# Altium schematic sheet Digital_Input.SchDoc
size A3; SheetNumber: 9; SheetTotal: 29
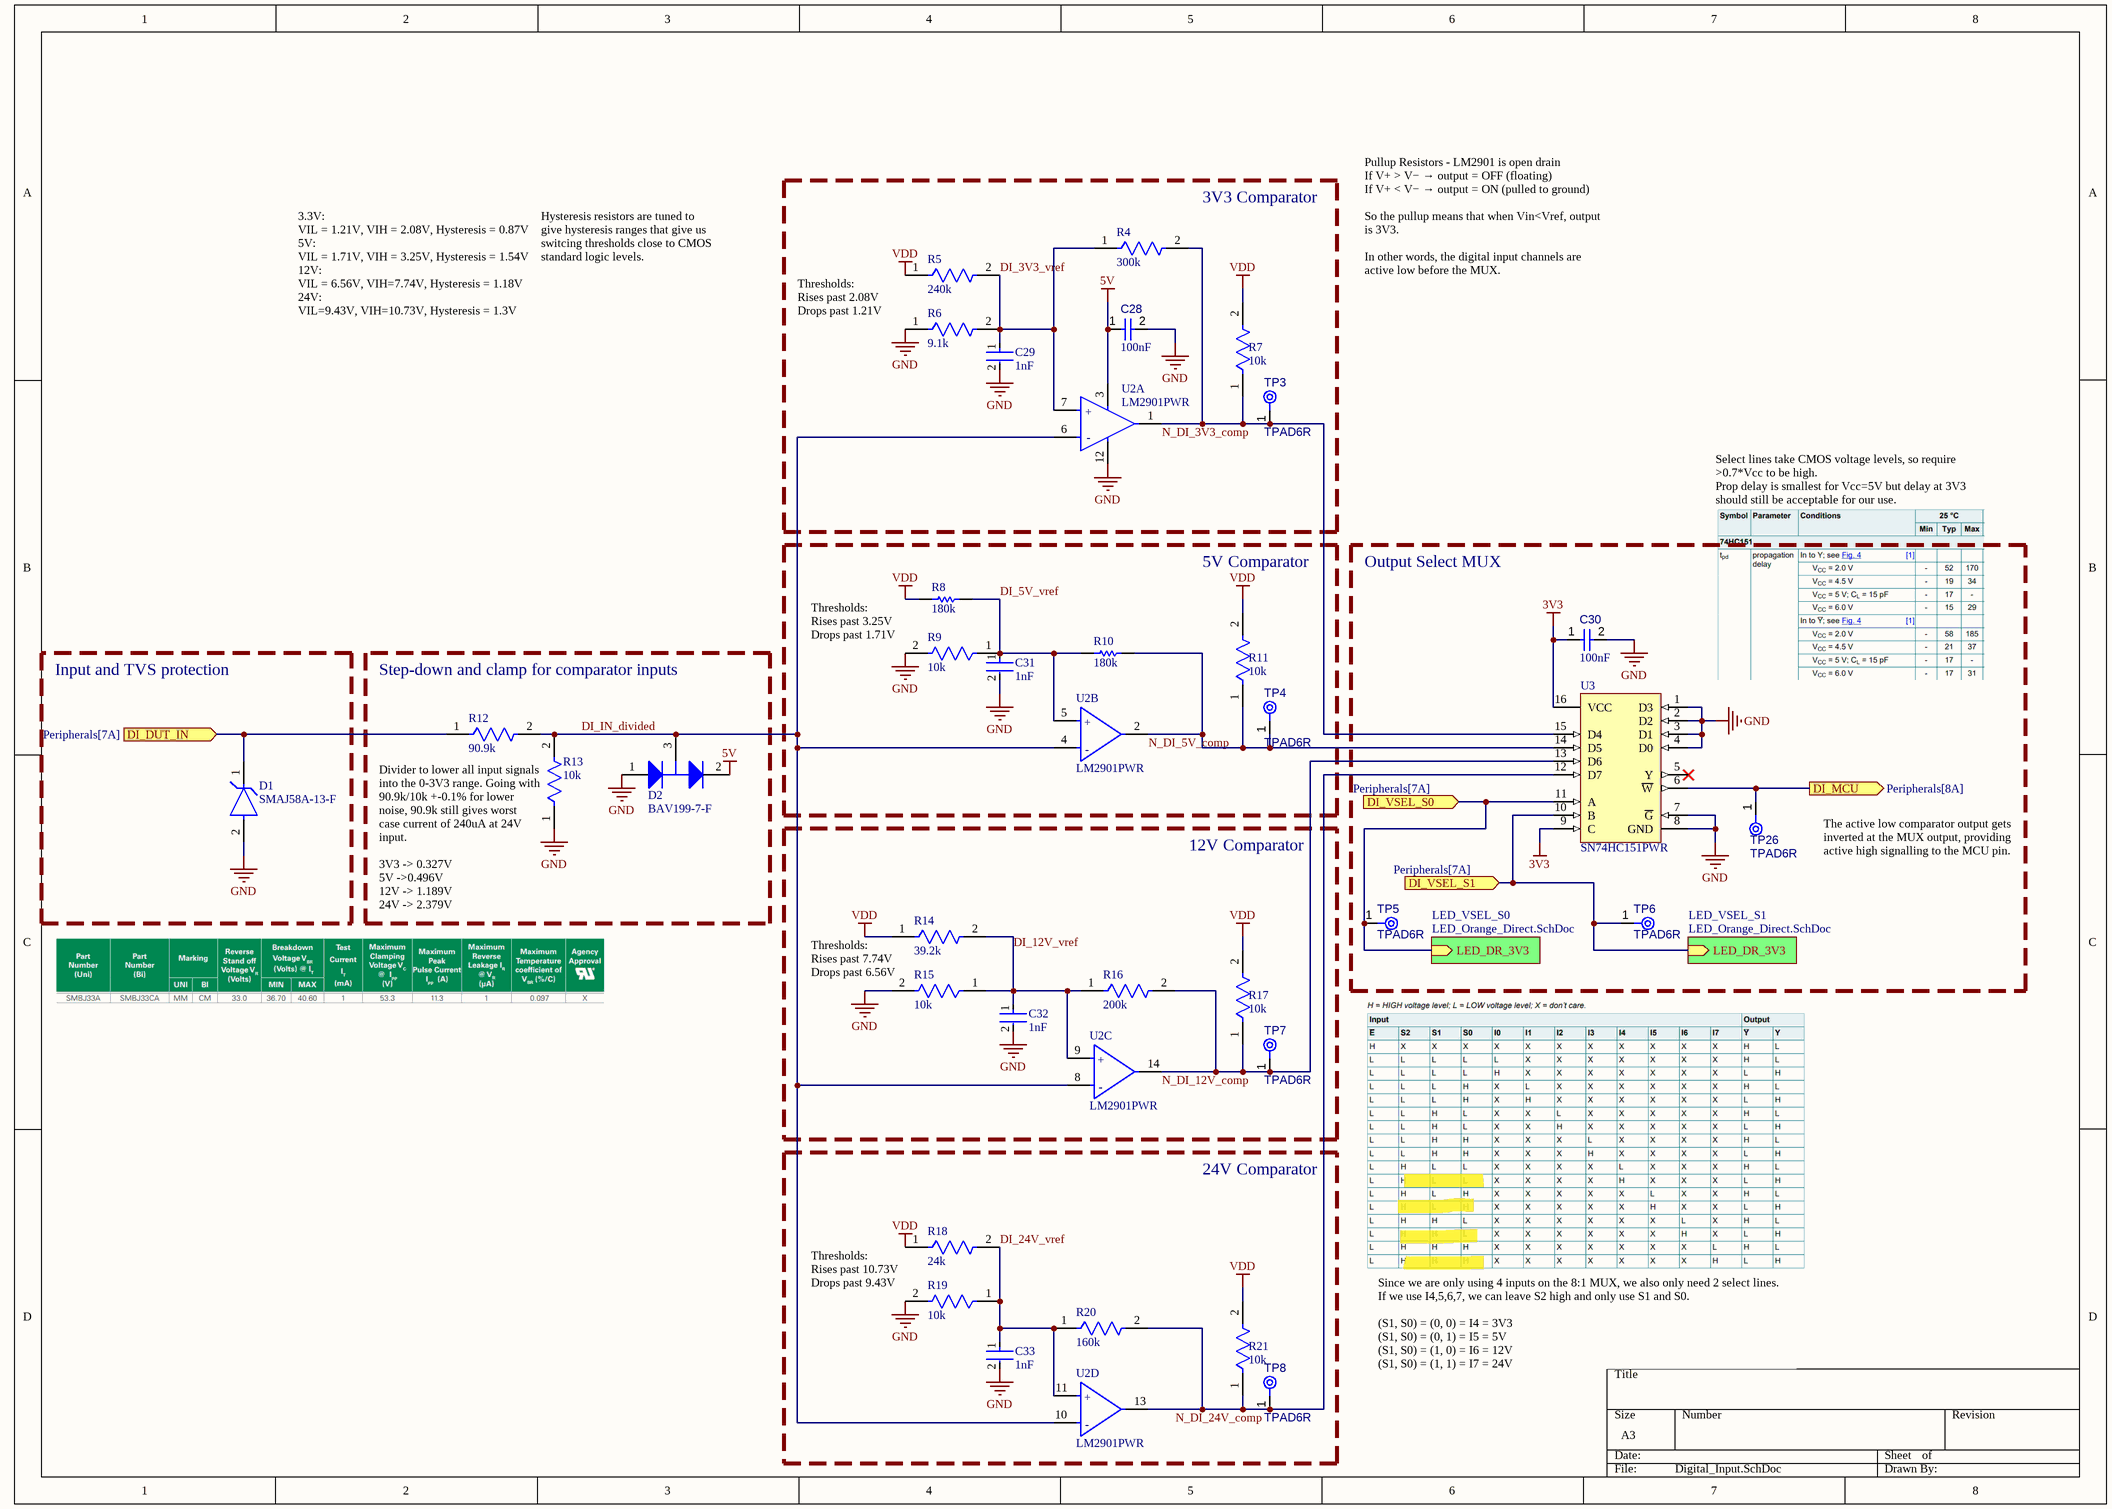
[diagram p0: Digital_Input.SchDoc]

## Parts
C28  value 100nF  [CAPC1608X90X40NL10T20]  (hidden comment: Capacitor 100 nF +/-10% 50 V 0603)
C29  value 1nF  [FP-CC0603-DA-IPC_B]  (hidden comment: CC0603KRX7R7BB102)
C30  value 100nF  [CAPC1608X90X40NL10T20]  (hidden comment: Capacitor 100 nF +/-10% 50 V 0603)
C31  value 1nF  [FP-CC0603-DA-IPC_B]  (hidden comment: CC0603KRX7R7BB102)
C32  value 1nF  [FP-CC0603-DA-IPC_B]  (hidden comment: CC0603KRX7R7BB102)
C33  value 1nF  [FP-CC0603-DA-IPC_B]  (hidden comment: CC0603KRX7R7BB102)
D1  SMAJ58A-13-F  [FP-SMA-MFG]
D2  BAV199-7-F  [DIOD-SOT23-3_A_V]
R4  value 300k  [FP-RT0603-IPC_C]  (hidden comment: RT0603BRE07300KL)
R5  value 240k  [FP-RT0603-IPC_C]  (hidden comment: RT0603BRD07240KL)
R6  value 9.1k  [FP-RT0603-IPC_C]  (hidden comment: RT0603BRD079K1L)
R7  value 10k  [FP-RT0603-IPC_C]  (hidden comment: RT0603BRD0710KL)
R8  value 180k  [RESC1608X55X30NL20T20]  (hidden comment: ERA-3AEB184V)
R9  value 10k  [FP-RT0603-IPC_C]  (hidden comment: RT0603BRD0710KL)
R10  value 180k  [RESC1608X55X30NL20T20]  (hidden comment: ERA-3AEB184V)
R11  value 10k  [FP-RT0603-IPC_C]  (hidden comment: RT0603BRD0710KL)
R12  value 90.9k  [FP-RT0603-IPC_C]  (hidden comment: RT0603BRD0790K9L)
R13  value 10k  [FP-RT0603-IPC_C]  (hidden comment: RT0603BRD0710KL)
R14  value 39.2k  [FP-RT0603-IPC_C]  (hidden comment: RT0603BRD0739K2L)
R15  value 10k  [FP-RT0603-IPC_C]  (hidden comment: RT0603BRD0710KL)
R16  value 200k  [FP-AT0603-IPC_A]  (hidden comment: AT0603BRD07200KL)
R17  value 10k  [FP-RT0603-IPC_C]  (hidden comment: RT0603BRD0710KL)
R18  value 24k  [FP-TNPW0603-e3-IPC_A]  (hidden comment: TNPW060324K0BEEA)
R19  value 10k  [FP-RT0603-IPC_C]  (hidden comment: RT0603BRD0710KL)
R20  value 160k  [FP-RT0603-IPC_C]  (hidden comment: RT0603BRD07160KL)
R21  value 10k  [FP-RT0603-IPC_C]  (hidden comment: RT0603BRD0710KL)
TP3  TPAD6R  [TP06R]  (no BOM)
TP4  TPAD6R  [TP06R]  (no BOM)
TP5  TPAD6R  [TP06R]  (no BOM)
TP6  TPAD6R  [TP06R]  (no BOM)
TP7  TPAD6R  [TP06R]  (no BOM)
TP8  TPAD6R  [TP06R]  (no BOM)
TP26  TPAD6R  [TP06R]  (no BOM)
U2  LM2901PWR  [FP-PW0014A-IPC_B]  (parts A,B,C,D of 4)
U3  SN74HC151PWR  [PW0016A_L]

## Blocks framed on the sheet
3V3 Comparator: C28 C29 R4-R7 TP3 U2
5V Comparator: C31 R8-R11 TP4 U2
Output Select MUX: C30 TP5 TP6 TP26 U3
Input and TVS protection: D1
Step-down and clamp for comparator inputs: D2 R12 R13
12V Comparator: C32 R14-R17 TP7 U2
24V Comparator: C33 R18-R21 TP8 U2

## Sub-sheets
LED_VSEL_S0 = LED_Orange_Direct.SchDoc: LED_DR_3V3 (in)
LED_VSEL_S1 = LED_Orange_Direct.SchDoc: LED_DR_3V3 (in)

## Ports
DI_DUT_IN (in, see Peripherals[7A]), DI_MCU (out, see Peripherals[8A]), DI_VSEL_S0 (in, see Peripherals[7A]), DI_VSEL_S1 (in, see Peripherals[7A])

## Nets
3V3: C30.1 U3.9(C) U3.16(VCC)
5V: C28.1 D2.2(K) U2.3(VCC)
GND: C28.2 C29.2 C30.2 C31.2 C32.2 C33.2 D1.2(A) D2.1(A) R6.1 R9.2 R13.1 R15.2 R19.2 U2.12(GND) U3.1(D3) U3.2(D2) U3.3(D1) U3.4(D0) U3.7(~{G}) U3.8(GND)
VDD: R5.1 R7.2 R8.1 R11.2 R14.1 R17.2 R18.1 R21.2
DI_3V3_vref: C29.1 R4.1 R5.2 R6.2 U2.7(1IN+)
DI_5V_vref: C31.1 R8.2 R9.1 R10.1 U2.5(2IN+)
DI_12V_vref: C32.1 R14.2 R15.1 R16.1 U2.9(3IN+)
DI_24V_vref: C33.1 R18.2 R19.1 R20.1 U2.11(4IN+)
DI_DUT_IN: D1.1(C) R12.1 ; port DI_DUT_IN
DI_IN_divided: D2.3(C) R12.2 R13.2 U2.4(2IN-) U2.6(1IN-) U2.8(3IN-) U2.10(4IN-)
DI_MCU: TP26.1(TP) U3.6(~{W}) ; port DI_MCU
DI_VSEL_S0: TP5.1(TP) U3.11(A) ; port DI_VSEL_S0, sheet LED_VSEL_S0/LED_DR_3V3
DI_VSEL_S1: TP6.1(TP) U3.10(B) ; port DI_VSEL_S1, sheet LED_VSEL_S1/LED_DR_3V3
N_DI_3V3_comp: R4.2 R7.1 TP3.1(TP) U2.1(1OUT) U3.15(D4)
N_DI_5V_comp: R10.2 R11.1 TP4.1(TP) U2.2(2OUT) U3.14(D5)
N_DI_12V_comp: R16.2 R17.1 TP7.1(TP) U2.14(OUT3) U3.13(D6)
N_DI_24V_comp: R20.2 R21.1 TP8.1(TP) U2.13(OUT4) U3.12(D7)

Not connected (* = marked no-connect by the designer): U3 5(Y)*

## Notes on the sheet
- 3.3V:
  VIL = 1.21V, VIH = 2.08V, Hysteresis = 0.87V
  5V:
  VIL = 1.71V, VIH = 3.25V, Hysteresis = 1.54V
  12V:
  VIL = 6.56V, VIH=7.74V, Hysteresis = 1.18V
  24V:
  VIL=9.43V, VIH=10.73V, Hysteresis = 1.3V
- Hysteresis resistors are tuned to give hysteresis ranges that give us switcing thresholds close to CMOS standard logic levels.
- Pullup Resistors - LM2901 is open drain
  If V+ > V− → output = OFF (floating)
  If V+ < V− → output = ON (pulled to ground)
  So the pullup means that when Vin<Vref, output is 3V3.
  In other words, the digital input channels are active low before the MUX.
- Thresholds:
  Rises past 2.08V
  Drops past 1.21V
- Select lines take CMOS voltage levels, so require >0.7*Vcc to be high.
  Prop delay is smallest for Vcc=5V but delay at 3V3 should still be acceptable for our use.
- Thresholds:
  Rises past 3.25V
  Drops past 1.71V
- The active low comparator output gets inverted at the MUX output, providing active high signalling to the MCU pin.
- (near R13) Divider to lower all input signals into the 0-3V3 range. Going with 90.9k/10k +-0.1% for lower noise, 90.9k still gives worst case current of 240uA at 24V input.
  3V3 -> 0.327V
  5V ->0.496V
  12V -> 1.189V
  24V -> 2.379V
- Thresholds:
  Rises past 7.74V
  Drops past 6.56V
- Thresholds:
  Rises past 10.73V
  Drops past 9.43V
- Since we are only using 4 inputs on the 8:1 MUX, we also only need 2 select lines.
  If we use I4,5,6,7, we can leave S2 high and only use S1 and S0.
  (S1, S0) = (0, 0) = I4 = 3V3
  (S1, S0) = (0, 1) = I5 = 5V
  (S1, S0) = (1, 0) = I6 = 12V
  (S1, S0) = (1, 1) = I7 = 24V
- (in symbol CMP-014-00007-1, part A) +; -
- (in symbol CMP-014-00007-1, part B) +; -
- (in symbol CMP-014-00007-1, part C) +; -
- (in symbol CMP-014-00007-1, part D) +; -

## Library data of the parts
C28 C30 = CMP-001-00017-6: Chip Capacitor, 100 nF, +/- 10%, 50 V, 0603 (1608 Metric); Voltage Rating: 50V; Capacitor Type: Ceramic; Tolerance: 10%; Mounting Technology: SM; Max Operating Temperature: 125°C; RoHS Compliant: True; Pins: 2; Case/Package: 0603; Min Operating Temperature: -55°C
C29 C31-C33 = CMP-001-00137-1: 16V 1nF X7R ±10% 0603 Multilayer Ceramic Capacitors MLCC - SMD/SMT ROHS; Min Operating Temperature: -55°C; Dielectric Material: Ceramic; Max Operating Temperature: 125°C; REACH SVHC: Yes; Lifecycle Status: Production; Voltage Rating: 16V; Mounting Technology: Surface Mount; Width: 800µm; Height: 800µm; Case/Package: 0603; RoHS: Compliant; Voltage Rating (DC): 16V; Length: 1.6mm; Number of Terminals: 2; Tolerance: 10%; Dielectric: X7R; Material: Ceramic; China RoHS: Compliant; Case Code (Imperial): 0603; Case Code (Metric): 1608; Composition: Ceramic; Depth: 800µm; Halogen Free: Halogen Free; Lead Free: Lead Free; Packaging: Tape and Reel; Radiation Hardening: No; Schedule B: 8532240020, 8532240020; Termination: SMD/SMT; Thickness: 889µm; Weight: 2.012816mg
D1 = CMP-004-00082-1: SMAJ Series 58 V 400 W SMT Uni-Directional TVS Diode - DO-214AC; Forward Voltage: 3.5V; Max Surge Current: 40A; Case/Package: SMA; Max Operating Temperature: 150°C; Min Operating Temperature: -55°C; Mounting Technology: Surface Mount; Pins: 2
D2 = CMP-004-00056-1: Diode Standard Recovery Rectifier 85 Volt 0.16A 3-Pin SOT-23 Tape and Reel; Max Surge Current: 4A; Forward Current: 150mA; Forward Voltage: 900mV; Pins: 3; Case/Package: SOT-23; Max Operating Temperature: 150°C; Mounting Technology: Surface Mount; Min Operating Temperature: -65°C
R4 = CMP-009-00251-1: 100mW Thin Film Resistor ±50ppm/℃ ±0.1% 300kΩ 0603 Chip Resistor - Surface Mount ROHS; Voltage Rating (DC): 50V; Voltage Rating: 75V; Temperature Coefficient: 50ppm/°C; Min Operating Temperature: -55°C; Export Control Classification Number (ECCN) Code: EAR99; China RoHS: Non-Compliant; Number of Terminals: 2; Max Power Dissipation: 100mW; Radiation Hardening: No; Mounting Technology: Surface Mount; Width: 800µm; Case Code (Metric): 0603; RoHS: Compliant; Contact Plating: Tin; Lead Free: Lead Free; Power Dissipation: 100mW; Packaging: Tape & Reel (TR); Height: 450µm; Tolerance: 0.1%; REACH SVHC: Yes; Harmonized Tariff Schedule (HTS) Code: 8533.21.00.30; Length: 1.6mm; Max Operating Temperature: 155°C; Working Voltage: 75V; Case/Package: 0603; Power Rating: 100mW; Number of Terminations: 2; Country of Origin: Mainland China, Taiwan; Introduction Date: 2008-07-11; Lifecycle Status: Production; Composition: Thin Film
R5 = CMP-009-00288-1: Res Thin Film 0603 240K Ohm 0.1% 0.1W(1/10W) ±25ppm/C Pad SMD T/R; Temperature Coefficient: 25ppm/°C; Power Rating: 100mW; Voltage Rating (DC): 50V; Working Voltage: 75V; Height: 450µm; Max Operating Temperature: 155°C; Case/Package: 0603; Composition: Thin Film; China RoHS: Non-Compliant; Lifecycle Status: Production; Harmonized Tariff Schedule (HTS) Code: 8533.21.00.30; RoHS: Compliant; Mounting Technology: Surface Mount; Introduction Date: 2008-06-09; Tolerance: 0.1%; Features: Moisture Resistant; Export Control Classification Number (ECCN) Code: EAR99; Case Code (Imperial): 0603; Max Power Dissipation: 100mW; Voltage Rating: 75V; Min Operating Temperature: -55°C; Country of Origin: Mainland China, Taiwan; Schedule B: 8533210045, 8533210045; Number of Terminations: 2; Lead Free: Lead Free; Number of Terminals: 2; Length: 1.6mm; REACH SVHC: Yes; Width: 800µm; Radiation Hardening: No; Contact Plating: Tin; Termination: SMD/SMT
R6 = CMP-009-00287-1: 100mW Thin Film Resistor 75V ±25ppm/℃ ±0.1% 9.1kΩ 0603 Chip Resistor - Surface Mount ROHS; Temperature Coefficient: 25ppm/°C; Voltage Rating (DC): 50V; Case/Package: 0603; REACH SVHC: Yes; Height: 450µm; Max Operating Temperature: 155°C; Width: 800µm; Termination: SMD/SMT; Weight: 2.012816mg; Lead Free: Lead Free; Radiation Hardening: No; Number of Terminals: 2; Harmonized Tariff Schedule (HTS) Code: 8533.21.00.30; RoHS: Compliant; Composition: Thin Film; Case Code (Imperial): 0603; Country of Origin: Mainland China, Taiwan; Max Power Dissipation: 100mW; Voltage Rating: 75V; Introduction Date: 2008-07-11; Depth: 800µm; Number of Terminations: 2; Length: 1.6mm; Export Control Classification Number (ECCN) Code: EAR99; Military Standard: Not; Schedule B: 8533210045, 8533210045; Tolerance: 0.1%; Working Voltage: 75V; Lifecycle Status: Production; Power Rating: 100mW; Mounting Technology: Surface Mount; Features: Moisture Resistant; Min Operating Temperature: -55°C; Contact Plating: Tin; China RoHS: Non-Compliant
R7 R11 R17 R21 = CMP-009-00322-1: Res Thin Film 0603 10K Ohm 0.1% 1/10W |25ppm/|C SMD Paper T/R; Voltage Rating: 75V; Max Power Dissipation: 100mW; Temperature Coefficient: 25ppm/°C; Min Operating Temperature: -55°C; Case/Package: 0603; Mounting Technology: Surface Mount; Max Operating Temperature: 155°C; Tolerance: 0.1%; Case Code (Imperial): 0603; China RoHS: Non-Compliant; Composition: Thin Film; Country of Origin: Mainland China, Taiwan; Depth: 800µm; Export Control Classification Number (ECCN) Code: EAR99; Features: Moisture Resistant; Harmonized Tariff Schedule (HTS) Code: 8533.21.00.30; Height: 450µm; Introduction Date: 2008-06-09; Lead Free: Lead Free; Length: 1.6mm; Lifecycle Status: Production; Military Standard: Not; Number of Terminals: 2; Number of Terminations: 2; Power Rating: 100mW; REACH SVHC: Yes; RoHS: Compliant; Schedule B: 8533210045, 8533210045; Termination: SMD/SMT; Voltage Rating (DC): 75V; Weight: 2.012816mg; Width: 800µm; Working Voltage: 75V
R8 R10 = CMP-009-00332-1: Res Thin Film 0603 180K Ohm 0.1% 0.1W ±25ppm/°C Molded SMD Punched Carrier T/R; Manufacturer Lifecycle Status: ACTIVE; Part Series: Thin Film Chip Resistors, High Reliability Type; Max Power Dissipation: 100mW; Voltage Rating (DC): 75V; Min Operating Temperature: -55°C; Termination: SMD/SMT; Features: Automotive AEC-Q200; Radiation Hardening: No; REACH SVHC: Yes; Lifecycle Status: Production; Contact Plating: Tin; Mounting Technology: Surface Mount; Ratings: AEC-Q200; Case/Package: 0603; Depth: 800µm; Harmonized Tariff Schedule (HTS) Code: 8533.21.00.30; Schedule B: 8533210045, 8533210045; Composition: Thin Film; Number of Terminations: 2; Country of Origin: Japan; RoHS: Compliant; Working Voltage: 75V; Introduction Date: 2008-03-19; Temperature Coefficient: 25ppm/°C; Case Code (Imperial): 0603; Tolerance: 0.1%; Voltage Rating: 75V; Military Standard: Not; Packaging: Cut Tape; Power Rating: 100mW; Export Control Classification Number (ECCN) Code: EAR99; Number of Terminals: 2; Length: 1.6mm; Height: 450µm; Max Operating Temperature: 155°C; Lead Free: Lead Free; Pins: 2; Width: 800µm
R9 R13 R15 R19 = CMP-009-00322-1: Res Thin Film 0603 10K Ohm 0.1% 1/10W |25ppm/|C SMD Paper T/R; Power Rating: 100mW; Voltage Rating: 75V; Temperature Coefficient: 25ppm/°C; Width: 800µm; Country of Origin: Mainland China, Taiwan; Military Standard: Not; China RoHS: Non-Compliant; Composition: Thin Film; Schedule B: 8533210045, 8533210045; Max Operating Temperature: 155°C; Export Control Classification Number (ECCN) Code: EAR99; Lead Free: Lead Free; Number of Terminals: 2; Voltage Rating (DC): 75V; Introduction Date: 2008-06-09; Tolerance: 0.1%; Number of Terminations: 2; Case/Package: 0603; Depth: 800µm; Max Power Dissipation: 100mW; RoHS: Compliant; Harmonized Tariff Schedule (HTS) Code: 8533.21.00.30; Lifecycle Status: Production; Length: 1.6mm; Min Operating Temperature: -55°C; Features: Moisture Resistant; Case Code (Imperial): 0603; REACH SVHC: Yes; Mounting Technology: Surface Mount; Working Voltage: 75V; Height: 450µm; Termination: SMD/SMT; Weight: 2.012816mg
R12 = CMP-009-00290-1: 100mW Thin Film Resistor 75V ±25ppm/℃ ±0.1% 90.9kΩ 0603 Chip Resistor - Surface Mount ROHS; Temperature Coefficient: 25ppm/°C; Voltage Rating (DC): 50V; Features: Moisture Resistant; Schedule B: 8533210045, 8533210045; Case Code (Imperial): 0603; Radiation Hardening: No; Composition: Thin Film; Working Voltage: 75V; Harmonized Tariff Schedule (HTS) Code: 8533.21.00.30; Country of Origin: Mainland China, Taiwan; Lifecycle Status: Production; Export Control Classification Number (ECCN) Code: EAR99; Number of Terminals: 2; China RoHS: Non-Compliant; Width: 800µm; Number of Terminations: 2; Termination: SMD/SMT; Max Operating Temperature: 155°C; Introduction Date: 2008-06-09; Tolerance: 0.1%; Max Power Dissipation: 100mW; Military Standard: Not; RoHS: Compliant; Power Rating: 100mW; Voltage Rating: 75V; Height: 450µm; Min Operating Temperature: -55°C; Case/Package: 0603; Depth: 800µm; Length: 1.6mm; REACH SVHC: Yes; Lead Free: Lead Free; Contact Plating: Tin; Mounting Technology: Surface Mount
R14 = CMP-009-00347-1: 100mW Thin Film Resistor ±25ppm/℃ ±0.1% 39.2kΩ 0603 Chip Resistor - Surface Mount ROHS; Temperature Coefficient: 25ppm/°C; Voltage Rating: 75V; Voltage Rating (DC): 50V; Width: 800µm; Contact Plating: Tin; Mounting Technology: Surface Mount; Min Operating Temperature: -55°C; Case/Package: 0603; Termination: SMD/SMT; Case Code (Imperial): 0603; Number of Terminations: 2; Max Power Dissipation: 100mW; Lead Free: Lead Free; Schedule B: 8533210045, 8533210045; China RoHS: Non-Compliant; Height: 450µm; Length: 1.6mm; Military Standard: Not; Features: Moisture Resistant; Power Rating: 100mW; REACH SVHC: Yes; Radiation Hardening: No; Tolerance: 0.1%; Max Operating Temperature: 155°C; Lifecycle Status: Production; Working Voltage: 75V; Weight: 2.012816mg; Number of Terminals: 2; Composition: Thin Film; Depth: 800µm; RoHS: Compliant
R16 = CMP-009-00344-1: 100mW Thin Film Resistor ±25ppm/℃ ±0.1% 200kΩ 0603 Chip Resistor - Surface Mount ROHS; Voltage Rating: 75V; Temperature Coefficient: 25ppm/°C; Lifecycle Status: Production; Length: 1.6mm; Min Operating Temperature: -55°C; Number of Terminals: 2; Width: 800µm; Introduction Date: 2015-05-11; Mounting Technology: Surface Mount; Features: Anti-Sulfur, Automotive AEC-Q200, Moisture Resistant; Country of Origin: Mainland China, Taiwan; Tolerance: 0.1%; Export Control Classification Number (ECCN) Code: EAR99; Max Power Dissipation: 100mW; RoHS: Compliant; Power Rating: 100mW; Case/Package: 0603; Number of Terminations: 2; Working Voltage: 75V; Composition: Thin Film; REACH SVHC: Yes; Harmonized Tariff Schedule (HTS) Code: 8533.21.00.30; Max Operating Temperature: 155°C; China RoHS: Compliant; Height: 450µm; Ratings: AEC-Q200
R18 = CMP-009-00298-1: Res Thin Film 0603 24K Ohm 0.1% 1/8W ±25ppm/°C Molded SMD SMD Paper T/R; Max Power Dissipation: 100mW; Working Voltage: 75V; Voltage Rating (DC): 50V; Military Standard: Not; Radiation Hardening: No; Tolerance: 0.1%; Lifecycle Status: Production; Length: 1.55mm; Packaging: Tape & Reel; China RoHS: Compliant; Export Control Classification Number (ECCN) Code: EAR99; Lead Free: Lead Free; Number of Terminals: 2; Min Operating Temperature: -55°C; Depth: 850µm; Weight: 2.012816mg; Contact Plating: Tin; Composition: Thin Film; Country of Origin: Germany, Israel; Schedule B: 8533210045, 8533210045; Power Rating: 100mW; Case Code (Metric): 1608; Termination: SMD/SMT; Width: 850µm; Height: 450µm; Number of Terminations: 2; Introduction Date: 2006-07-14; Ratings: AEC-Q200; Case Code (Imperial): 0603; Voltage Rating: 75V; Mounting Technology: Surface Mount; Case/Package: 0603; REACH SVHC: Yes; Temperature Coefficient: 25ppm/°C; RoHS: Compliant; Harmonized Tariff Schedule (HTS) Code: 8533.21.00.30; Max Operating Temperature: 125°C; Features: Anti-Sulfur, Automotive AEC-Q200, Moisture Resistant; Pins: 2
R20 = CMP-009-00297-1: Res Thin Film 0603 160K Ohm 0.1% 0.1W(1/10W) ±25ppm/C Pad SMD T/R; Voltage Rating (DC): 50V; Temperature Coefficient: 25ppm/°C; Power Rating: 100mW; Working Voltage: 75V; Max Operating Temperature: 155°C; Tolerance: 0.1%; Case/Package: 0603; Composition: Thin Film; Mounting Technology: Surface Mount; Schedule B: 8533210045, 8533210045; Radiation Hardening: No; Military Standard: Not; Number of Terminals: 2; Number of Terminations: 2; Lifecycle Status: Production; China RoHS: Non-Compliant; Depth: 800µm; REACH SVHC: Yes; Max Power Dissipation: 100mW; Length: 1.6mm; Features: Moisture Resistant; Width: 800µm; Height: 450µm; Case Code (Imperial): 0603; Contact Plating: Tin; Termination: SMD/SMT; Voltage Rating: 75V; Lead Free: Lead Free; RoHS: Compliant; Weight: 2.012816mg; Min Operating Temperature: -55°C
TP3-TP8 TP26 = CMP-00028-00002-2: 0.6mm round; Pins: 1
U2 = CMP-014-00007-1: Cut Tape (CT) LM2901 CMOS MOS Open-Collector TTL 0.25muA comparator circuit 250nA 1.3mus 5mm 9V; Manufacturer Lifecycle Status: ACTIVE; Min Dual Supply Voltage: 1V; Max Supply Voltage: 30V; Max Supply Current: 2mA; Max Dual Supply Voltage: 15V; Max Junction Temperature (Tj): 125°C; Input Bias Current: -25nA; Number of Channels: 4; Input Offset Voltage (Vos): 2mV; Response Time: 1.3µs; Voltage Gain: 100dB; Min Supply Voltage: 2V; Operating Supply Voltage: 28V; Output Current per Channel: 20mA; Quiescent Current: 2.5mA; Mounting Technology: Surface Mount; Min Operating Temperature: -40°C; Lifecycle Status: Production; Max Input Current: 250nA; Length: 5mm; Lead Free: Lead Free; REACH SVHC: No; Height: 0m; Dual Supply Voltage: 9V; Thickness: 1mm; Pins: 14; Weight: 57.209338mg; Schedule B: 8542390000, 8542390000; Width: 4.4mm; Contact Plating: Gold; Packaging: Cut Tape; Radiation Hardening: No; Number of Elements: 4; Output Type: TTL; RoHS: Compliant; Max Operating Temperature: 125°C; Nominal Supply Current: 2mA; Case/Package: TSSOP
U3 = CMP-031-00026-2: Multiplexer 1-ELEMENT Cmos 8-IN 16-PIN TSSOP T/r / IC Selector/mux 8-1LINE 16-TSSOP; Manufacturer Lifecycle Status: ACTIVE; Min Supply Voltage: 2V; Low Level Output Current: 7.8mA; Number of Bits: 8; Number of Outputs: 1; Bandwidth: 28MHz; Supply Type: Single; Propagation Delay: 47ns; Max Supply Voltage: 6V; Operating Supply Voltage: 5V; Lead Free: Lead Free; Length: 5mm; Number of Channels: 1; Max Operating Temperature: 85°C; High Level Output Current: 7.8mA; Lifecycle Status: Production; Number of Input Lines: 8; Independent Circuits: 1; Contact Plating: Gold; Number of Output Lines: 1; Case/Package: TSSOP; Pins: 16; Schedule B: 8542390000, 8542390000; Number of Inputs: 8; Mounting Technology: Surface Mount; Min Operating Temperature: -40°C; Logic Function: Multiplexer; Thickness: 1mm; Width: 4.4mm; Radiation Hardening: No; RoHS: Compliant; Weight: 61.887009mg; Height: 1.2mm